# EAGLE design HerbScalesch (EAGLE 9.6.2)
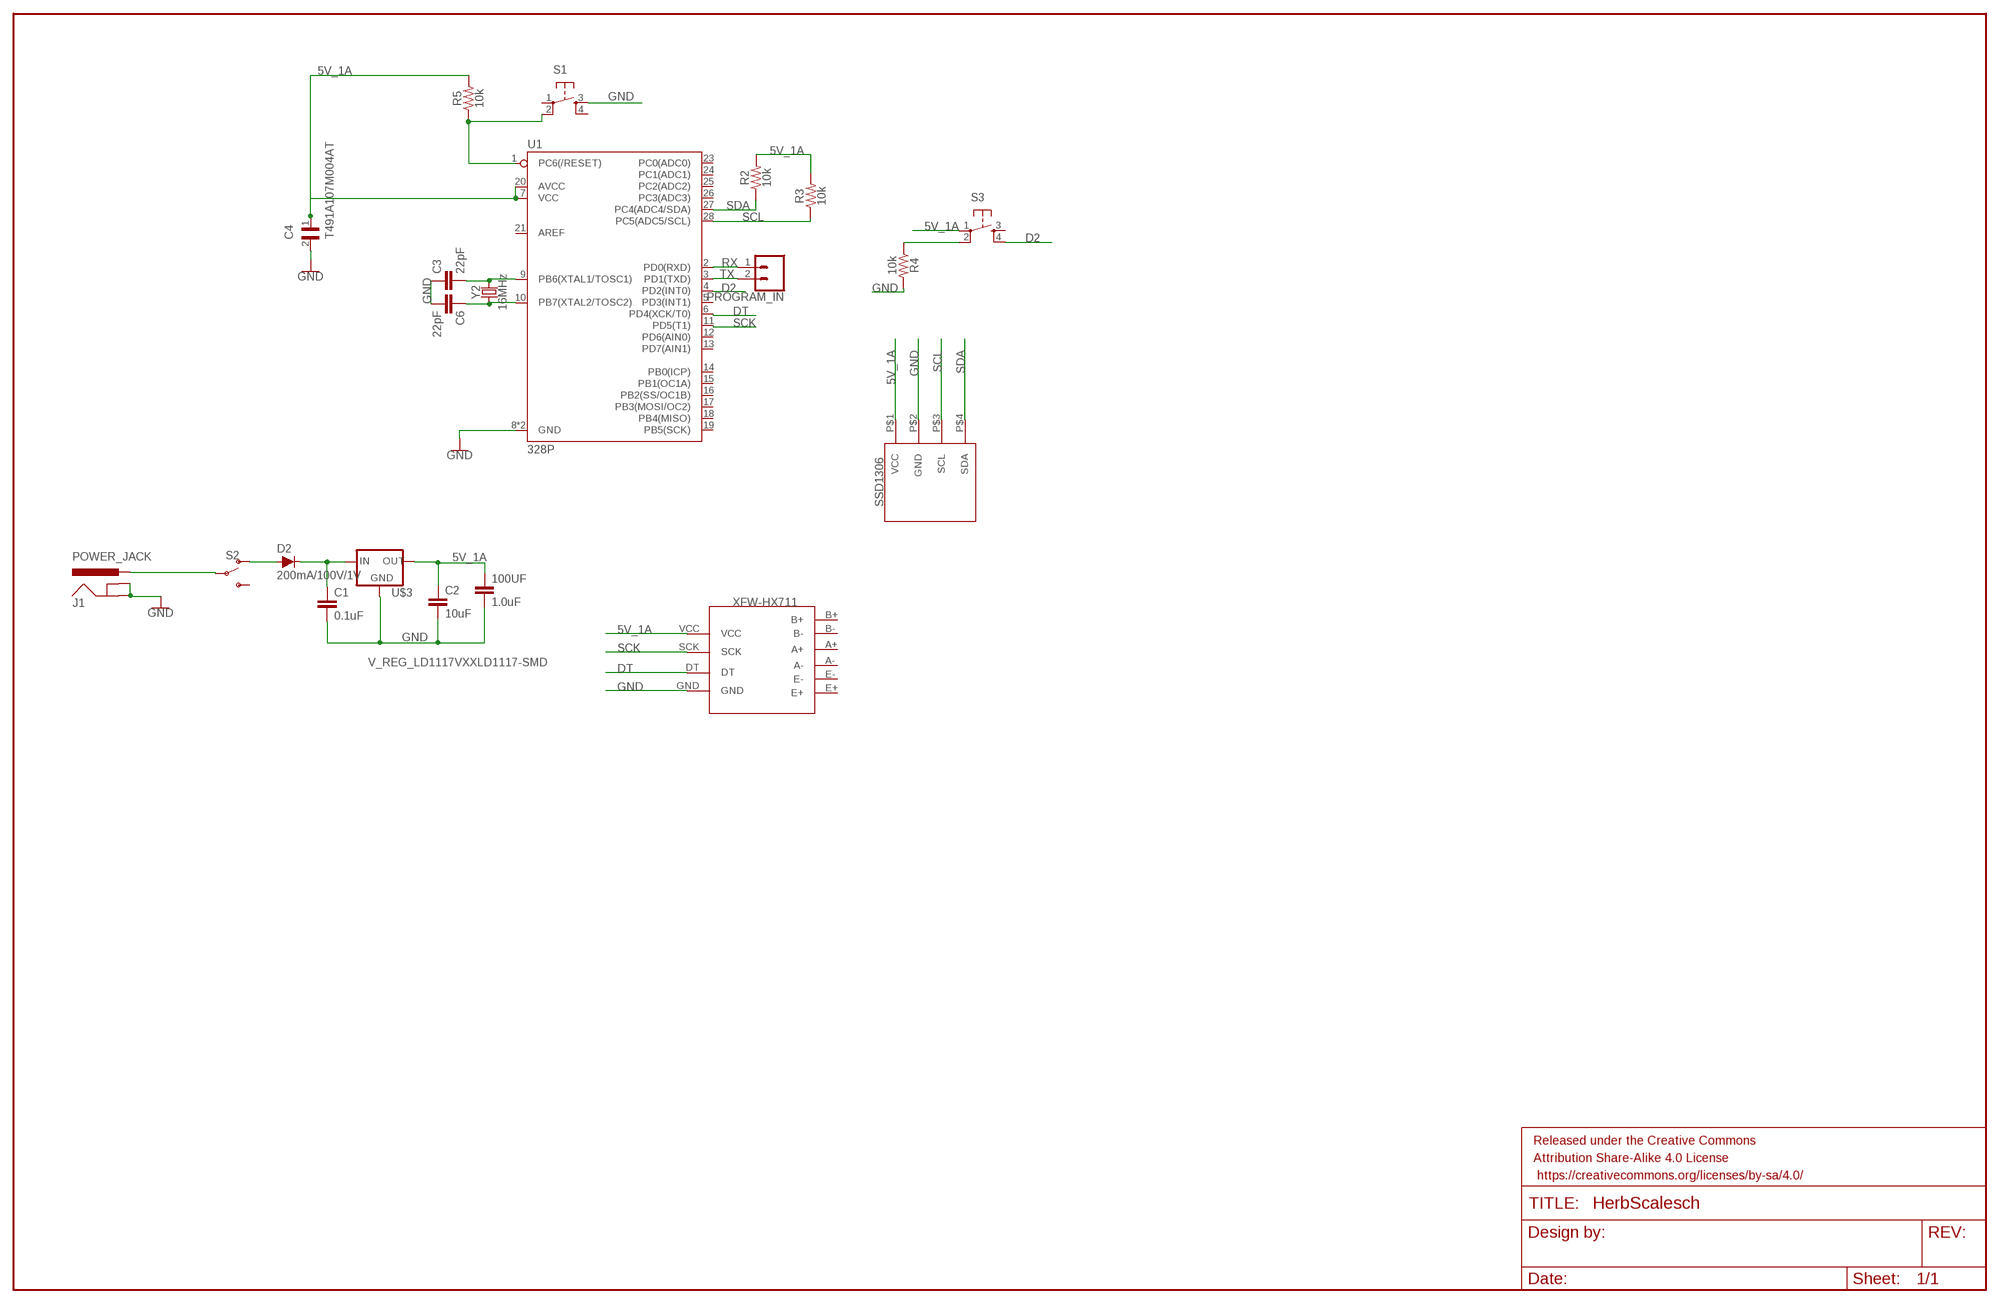
[diagram p0: schematic, sheet 1]

## Parts
100UF  1.0uF  1.0UF-1206-50V-10%  [1206]
C1  0.1uF  0.1UF-0603-25V-(+80/-20%)  [0603]
C2  10uF  10UF-0603-6.3V-20%  [0603]
C3  22pF  22PF-PTH-2.54MM-200V-5%  [CAP-PTH-2.54]
C4  T491A107M004AT  [CAPC3216X110N]
C6  22pF  22PF-PTH-2.54MM-200V-5%  [CAP-PTH-2.54]
D2  200mA/100V/1V  DIODE-1N4148  [DIODE-1N4148]
FRAME1  FRAME-LEDGER  [CREATIVE_COMMONS]
J1  POWER_JACK  [POWER_JACK_PTH]
PROGRAM_IN  CONN_02  [1X02]
R2  10k  10KOHM-HORIZ-1/4W-5%  [AXIAL-0.3]
R3  10k  10KOHM-HORIZ-1/4W-5%  [AXIAL-0.3]
R4  10k  10KOHM-HORIZ-1/4W-5%  [AXIAL-0.3]
R5  10k  10KOHM-HORIZ-1/4W-5%  [AXIAL-0.3]
S1  TAC_SWITCHPTH  [TACTILE-PTH]
S2  SWITCH-SPDT-PTH-11.6X4.0MM  [SWITCH_SPDT_PTH_11.6X4.0MM]
S3  TAC_SWITCHPTH  [TACTILE-PTH]
U1  328P  ATMEGA328P_PDIP  [DIP28]
U$1  SSD1306  [SSD1306]
U$2  XFW-HX711  [XFW-HX711]
U$3  V_REG_LD1117VXXLD1117-SMD  [SOT223]
Y2  16MHz  CRYSTAL-16MHZPTH-HC49US  [HC49US]

## Nets
5V_1A [5V]: 100UF.1 C2.1 C4.1 R2.P$2 R3.P$2 R5.P$2 S3.1 U1.7(VCC) U1.20(AVCC) U$1.P$1(VCC) U$2.VCC U$3.2(OUT)
D2 [Coms]: S3.4 U1.4(PD2(INT0))
DT [Coms]: U1.6(PD4(XCK/T0)) U$2.DT
GND: 100UF.2 C1.2 C2.2 C3.1 C4.2 C6.2 J1.GND J1.GNDBREAK R4.P$2 S1.3 U1.8(GND) U1.22(GND) U$1.P$2(GND) U$2.GND U$3.1(GND)
N$2 [5V]: C3.2 U1.9(PB6(XTAL1/TOSC1)) Y2.2
N$3: R5.P$1 S1.2 U1.1(PC6(/RESET))
N$4 [New Class]: D2.A S2.1(O)
N$5 [New Class]: C1.1 D2.C U$3.3(IN)
N$6 [5V]: C6.1 U1.10(PB7(XTAL2/TOSC2)) Y2.1
N$8: R4.P$1 S3.2
N$10 [New Class]: J1.PWR S2.2(P)
RX [Coms]: PROGRAM_IN.1 U1.2(PD0(RXD))
SCK [Coms]: U1.11(PD5(T1)) U$2.SCK
SCL [Coms]: R3.P$1 U1.28(PC5(ADC5/SCL)) U$1.P$3(SCL)
SDA [Coms]: R2.P$1 U1.27(PC4(ADC4/SDA)) U$1.P$4(SDA)
TX [Coms]: PROGRAM_IN.2 U1.3(PD1(TXD))
Unconnected: S1.1 S1.4 S2.3(S) S3.3 U1.5(PD3(INT1)) U1.12(PD6(AIN0)) U1.13(PD7(AIN1)) U1.14(PB0(ICP)) U1.15(PB1(OC1A)) U1.16(PB2(SS/OC1B)) U1.17(PB3(MOSI/OC2)) U1.18(PB4(MISO)) U1.19(PB5(SCK)) U1.21(AREF) U1.23(PC0(ADC0)) U1.24(PC1(ADC1)) U1.25(PC2(ADC2)) U1.26(PC3(ADC3)) U$2.A+ U$2.A- U$2.B+ U$2.B- U$2.E+ U$2.E-

## Library data of the parts
100UF = SparkFun-Capacitors:1.0UF: 1µF ceramic capacitors A capacitor is a passive two-terminal electrical component used to store electrical energy temporarily in an electric field.; PROD_ID: CAP-09822
C1 = SparkFun-Capacitors:0.1UF: 0.1µF ceramic capacitors A capacitor is a passive two-terminal electrical component used to store electrical energy temporarily in an electric field.; PROD_ID: CAP-00810
C2 = SparkFun-Capacitors:10UF: 10.0µF ceramic capacitors A capacitor is a passive two-terminal electrical component used to store electrical energy temporarily in an electric field.; PROD_ID: CAP-11015
C3 C6 = SparkFun-Capacitors:22PF: 22pF ceramic capacitors A capacitor is a passive two-terminal electrical component used to store electrical energy temporarily in an electric field.; PROD_ID: CAP-09128
C4 = T491A107M004AT:T491A107M004AT: Tantalum Capacitor; Capacitor Type:Solid; Capacitance:100µF; Capacitance Tolerance:± 20%; Voltage Rating:4VDC; Capacitor Dielectric Type:Tantalum; Package/Case:3216-18; Termination Type:SMD; ESR:4ohm; Leaded Process Compatible:Yes ;RoHS Compliant: Yes Check availability <https://pricing.snapeda.com/parts/T491A107M004AT/KEMET/view-part?ref=eda>; AVAILABILITY: In Stock; CHECK_PRICES: https://www.snapeda.com/parts/T491A107M004AT/KEMET/view-part/?ref=eda; DESCRIPTION: Capacitors Tantalum PCB 100uF SMD Tol 20% 4 VDC Case Size 3216 T491 Series | KEMET T491A107M004AT; MF: KEMET; MP: T491A107M004AT; PACKAGE: SMD-2 KEMET; PRICE: None; PURCHASE-URL: https://www.snapeda.com/api/url_track_click_mouser/?unipart_id=577514&manufacturer=KEMET&part_name=T491A107M004AT&search_term=t491a107m004at; SNAPEDA_LINK: https://www.snapeda.com/parts/T491A107M004AT/KEMET/view-part/?ref=snap
D2 = SparkFun-DiscreteSemi:DIODE: Diode These are standard reverse protection diodes and small signal diodes. SparkFun Products: SparkFun SparkPunk Sound Kit <https://www.sparkfun.com/products/11177> SparkFun ESP8266 Thing <https://www.sparkfun.com/products/13231>; PROD_ID: DIO-08378
FRAME1 = SparkFun-Aesthetics:FRAME-LEDGER: Schematic Frame - Ledger Standard 11x14 US Ledger frame
J1 = SparkFun-Connectors:POWER_JACK: Power Jack Connector This is the standard 5.5mm barrel jack for power. The PTH is the most common, proven, reliable, footprint. The Slot footprint only works if the mill layer is transmitted to the PCB fab house so be warned. Here are the connectors we sell at SparkFun: DC Barrel Power Jack/Connector <https://www.sparkfun.com/products/119> (PRT-00119) DC Barrel Power Jack/Connector (SMD) <https://www.sparkfun.com/products/12748> (PRT-12748) DC Barrel Jack Adapter - Breadboard Compatible <https://www.sparkfun.com/products/10811> (PRT-10811) It is used on this SparkFun product (and many, many others): SparkFun RedBoard - Programmed with Arduino <https://www.sparkfun.com/products/12757> (DEV-12757) Also, if you need a mating power supply or connector, please check these out: Wall Adapter Power Supply - 9VDC 650mA <https://www.sparkfun.com/products/298> (TOL-00298) DC Barrel Jack Adapter - Male <https://www.sparkfun.com/products/10287> (PRT-10287); PROD_ID: CONN-08197
PROGRAM_IN = SparkFun-Connectors:CONN_02: Multi connection point. Often used as Generic Header-pin footprint for 0.1 inch spaced/style header connections On any of the 0.1 inch spaced packages, you can populate with these: Break Away Headers - Straight <https://www.sparkfun.com/products/116> (PRT-00116) Break Away Male Headers - Right Angle <https://www.sparkfun.com/products/553> (PRT-00553) Female Headers <https://www.sparkfun.com/products/115> (PRT-00115) Break Away Headers - Machine Pin <https://www.sparkfun.com/products/117> (PRT-00117) Break Away Female Headers - Swiss Machine Pin <https://www.sparkfun.com/products/743> (PRT-00743) For SCREWTERMINALS and SPRING TERMINALS visit here: Screw Terimnals on SparkFun.com <https://www.sparkfun.com/search/results?term=Screw+Terminals> (5mm/3.5mm/2.54mm spacing) This device is also useful as a general connection point to wire up your design to another part of your project. Our various solder wires solder well into these plated through hole pads. Hook-Up Wire - Assortment (Stranded, 22 AWG) <https://www.sparkfun.com/products/11375> (PRT-11375) Hook-Up Wire - Assortment (Solid Core, 22 AWG) <https://www.sparkfun.com/products/11367> (PRT-11367) View the entire wire category on our website here <https://www.sparkfun.com/categories/141> Special notes: Molex polarized connector foot print use with: PRT-08233 with associated crimp pins and housings. 2.54_SCREWTERM for use with PRT-10571. 3.5mm Screw Terminal footprints for PRT-08084 5mm Screw Terminal footprints for use with PRT-08432
R2-R5 = SparkFun-Resistors:10KOHM: 10kΩ resistor A resistor is a passive two-terminal electrical component that implements electrical resistance as a circuit element. Resistors act to reduce current flow, and, at the same time, act to lower voltage levels within circuits. - Wikipedia; PROD_ID: RES-09435
S1 S3 = SparkFun-Retired:TAC_SWITCH: Momentary Switch Button commonly used for reset or general input. Spark Fun Electronics SKU : COM-00097 SMT- SWCH-08247
S2 = SparkFun-Switches:SWITCH-SPDT: Single Pole, Double Throw (SPDT) Switch Single-pole, double-throw (SPDT) switch. Variant Overview SMD-AYZ0202 Surface Mount DPDT Switch <https://www.sparkfun.com/products/597> (COM-00597) Used on e.g. LilyPad Arduino USB - ATmega32U4 Board <https://www.sparkfun.com/products/12049> PTH-11.6X4.0MM SPDT Mini Power Switch <https://www.sparkfun.com/products/102> (COM-00102) Used on e.g. SparkFun Simon Says - Through-Hole Soldering Kit <https://www.sparkfun.com/products/10547> (KIT-10547) PTH-11.6X4.0MM-KIT KIT version of SPDT Mini Power Switch - Simplifies soldering by removing tStop of switch pins - only one side can be soldered. PTH-11.6X4.0MM-LOCK LOCK version of SPDT Mini Power Switch - Offset pins hold switch in place for easier soldering. SMD-RIGHT-ANGLE Surface Mount Right Angle Switch <https://www.sparkfun.com/products/10860> (COM-10860) Used on e.g. SparkFun ESP8266 Thing <https://www.sparkfun.com/products/13231>; PROD_ID: SWCH-08261; SF_SKU: COM-00102
U1 = SparkFun-IC-Microcontroller:ATMEGA328P_PDIP: Atmel 328P Through hole ATMEGA328P uC used in the Arduino 32kb flash, 1k EEPROM, 2k SRAM Datasheet <http://www.sparkfun.com/datasheets/Components/SMD/ATMega328.pdf> SparkFun Products Storefront component: AVR 28 Pin 20MHz 32K 6A/D - ATMega328P <https://www.sparkfun.com/products/9061> (COM-09061) SparkFun Simon Says - Through-Hole Soldering Kit <https://www.sparkfun.com/products/10547> (KIT-10547) SparkFun Learn to Solder - Simon Says <https://www.sparkfun.com/products/13708> (KIT-13708) SparkFun BigTime Watch Kit <https://www.sparkfun.com/products/11734> (KIT-11734) SparkFun ClockIt <https://www.sparkfun.com/products/10930> (KIT-10930) SparkFun Serial Enabled LCD Kit <https://www.sparkfun.com/products/10097> (LCD-10097) SparkFun Simon Tilts - Through Hole Soldering Kit <https://www.sparkfun.com/products/12634> (KIT-12634) SparkFun Frequency Counter Kit <https://www.sparkfun.com/products/10140> (KIT-10140) FabFM Radio Kit <https://www.sparkfun.com/products/11043> (KIT-11043) SparkFun Binary Blaster Kit <https://www.sparkfun.com/products/12037> (KIT-12037) SparkFun Metro-Gnome <https://www.sparkfun.com/products/9236> (KIT-09236) ATmega328 with Arduino Optiboot (Uno) <https://www.sparkfun.com/products/10524> (DEV-10524); PROD_ID: IC-09136
U$1 = SV-Misc:SSD1306: Arduino OLED SSD1306
U$2 = SV-Misc:XFW-HX711
U$3 = SparkFun-IC-Power:V_REG_LD1117VXX: LD1117VXX voltage regulator. We carry the 3.3V version (COM-00526) in TO-220 package.; PROD_ID: VREG-13917
Y2 = SparkFun-Clocks:CRYSTAL-16MHZ: 16MHz Crystal Digikey Example <http://www.digikey.com/product-search/en?keywords=535-9122-1-ND> Frequency: 16MHz Frequency Stability: ±50ppm Frequency Tolerance: ±20ppm Load Capacitance: 18pF SparkFun Products: Pro Micro -5V/16MHz <https://www.sparkfun.com/products/12640> SparkFun Serial Enabled LCD Kit <https://www.sparkfun.com/products/10097>; PROD_ID: XTAL-08181; SF_ID: COM-00536

## Net classes
0 GND: width 0.508 mm
1 New Class: width 0.508 mm
2 5V: width 0.305 mm
3 Coms: width 0.254 mm

## Board
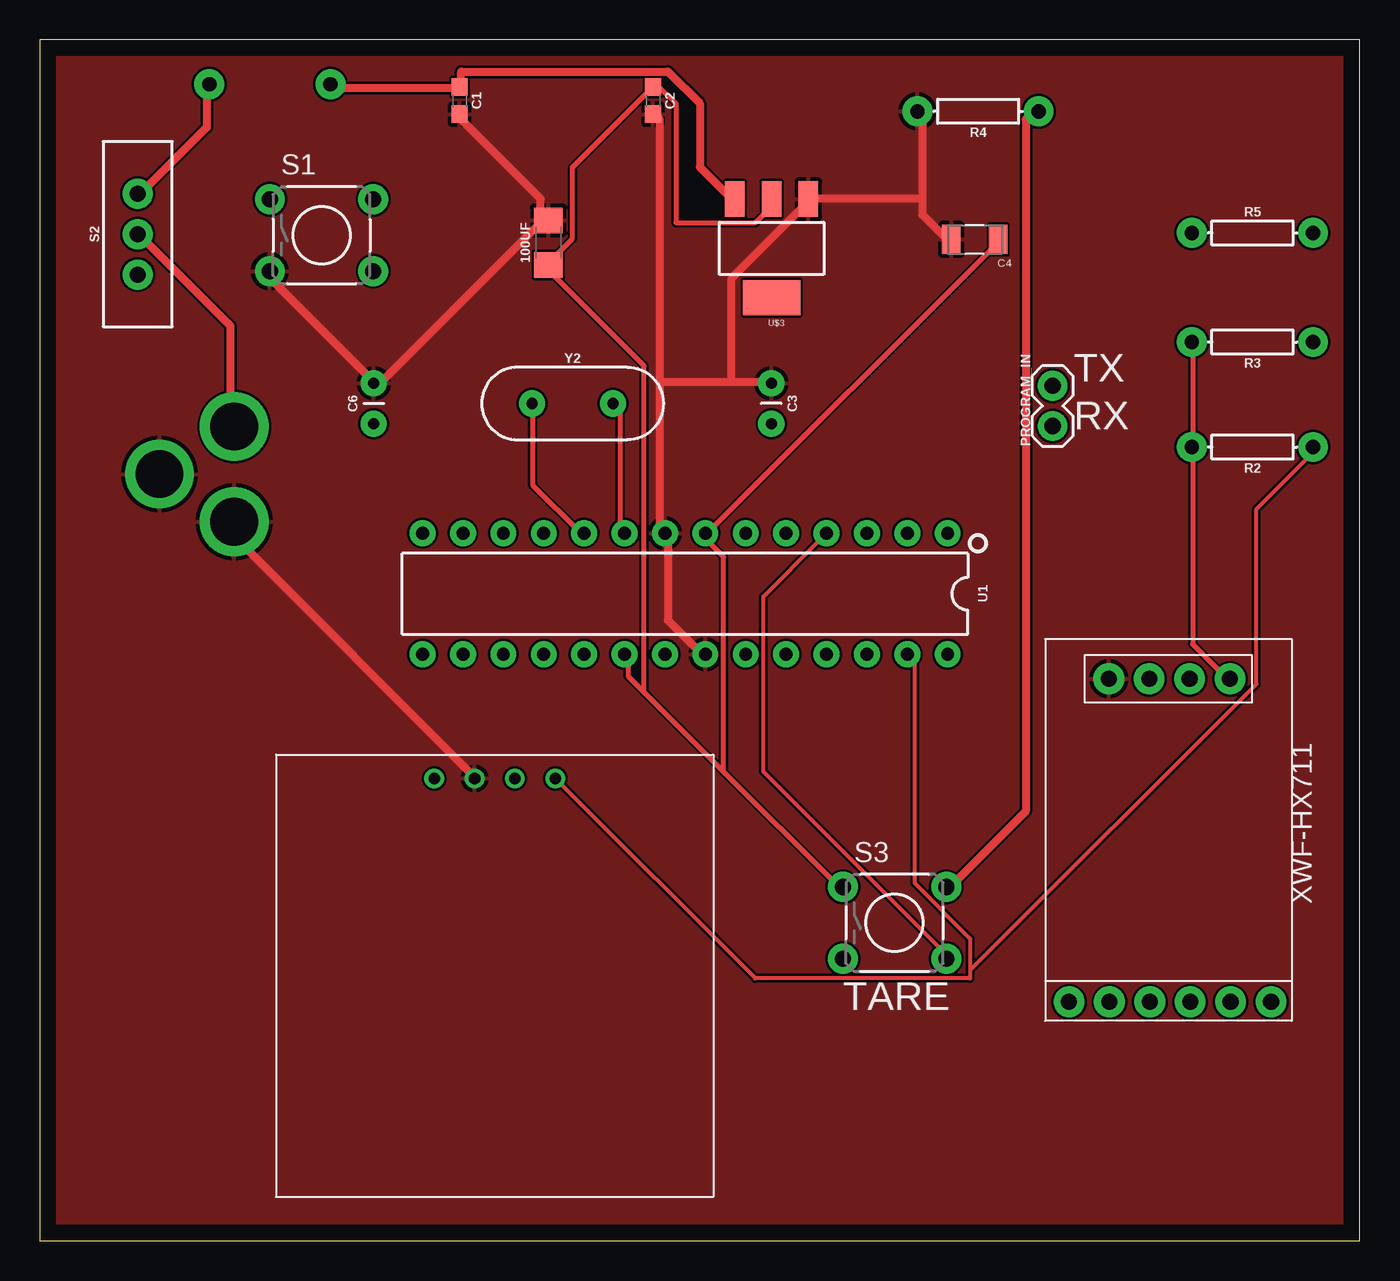
[diagram p1: board, top side]
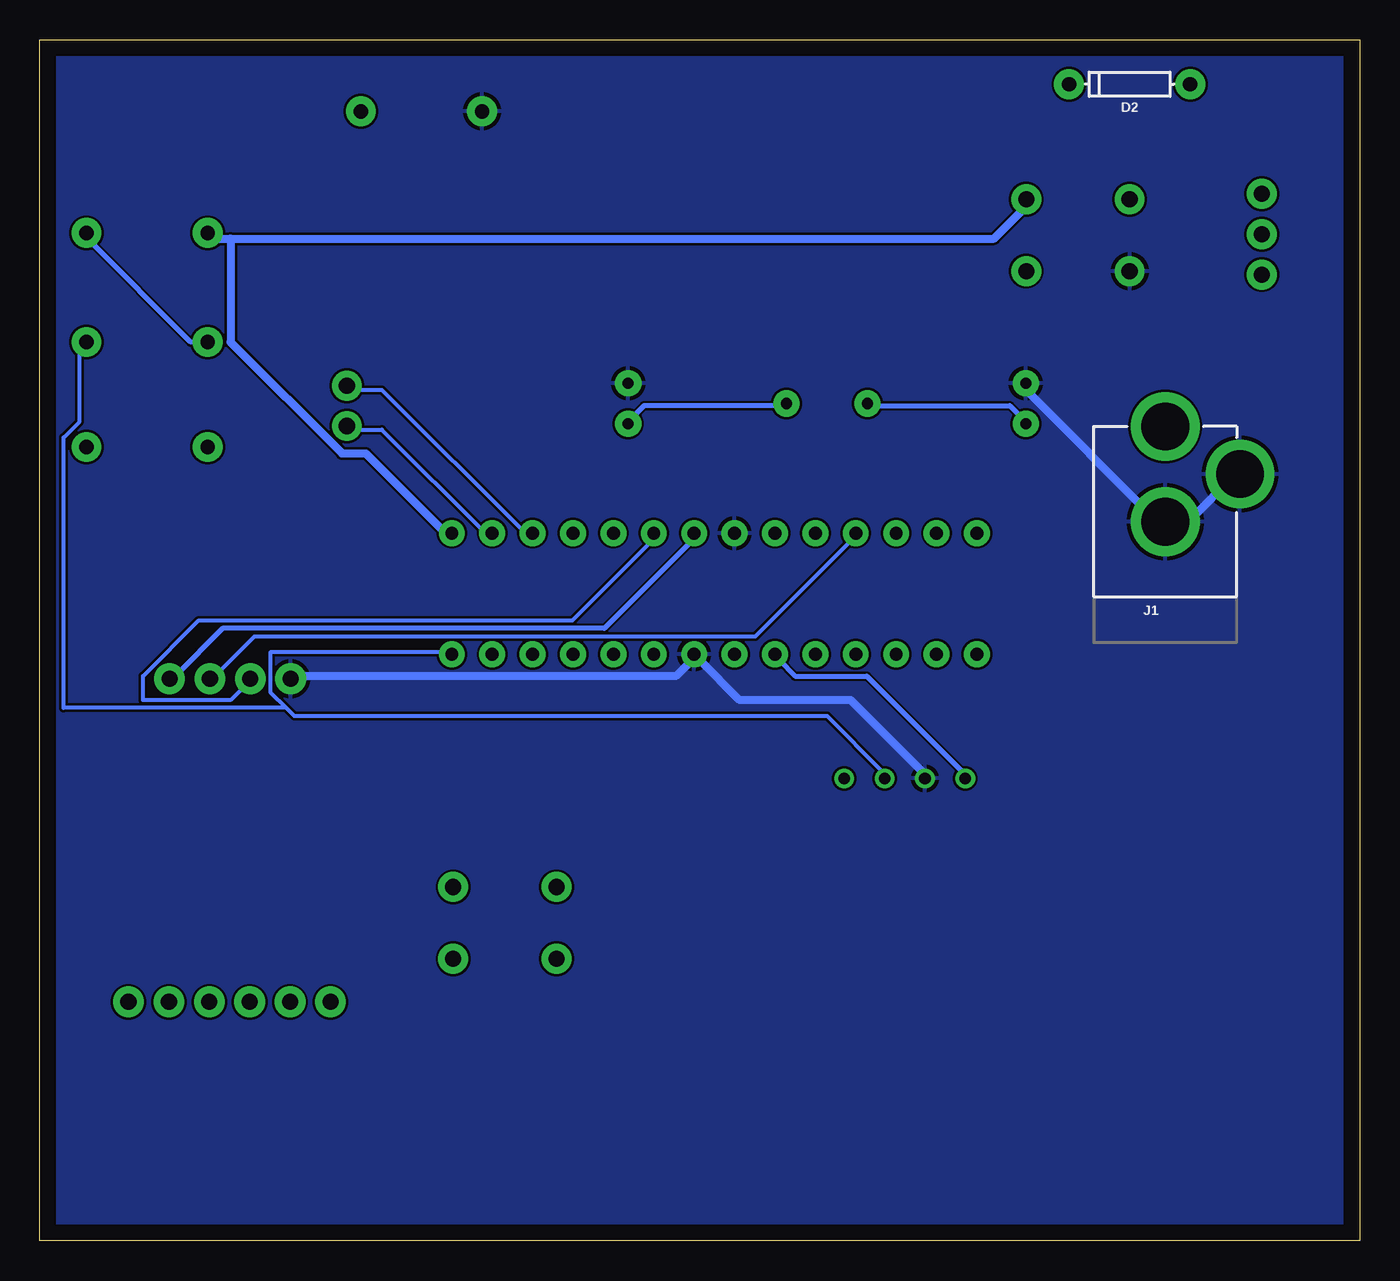
[diagram p2: board, bottom side, seen from below]

Size 83 x 75.5 mm. Coordinates in mm from the lower left corner, seen from the top.
Outline: 0,0 83,0 83,75.5 0,75.5 0,0
Copper layers (1*16): Top 0.035mm / dielectric 1.5mm / Bottom 0.035mm
Design rules "default": minimum track width 6mil, minimum drill 0.35mm, track to track 6mil, track to pad 6mil, pad to pad 6mil, via to via 6mil, smd to smd 6mil, copper to edge 40mil, drill to drill 6mil, minimum pad ring 10mil, minimum via ring 8mil, stop-mask expansion 4mil, vias tented up to drill 0mil, thermal gap 10mil

### Footprints (pad centres in the part's own frame; a part is rotated, then mirrored left to right if it is on the bottom)
1206 = smd 1.6 x 1.8: 1 -1.4,0; 2 1.4,0
0603 = smd 1.1 x 1: 1 -0.85,0; 2 0.85,0
CAP-PTH-2.54 = drill 0.7 pad 1.651: 1 -1.27,0; 2 1.27,0
CAPC3216X110N = smd 1.16 x 1.82: 1 -1.475,0; 2 1.475,0
DIODE-1N4148 = drill 0.9 pad 1.88: A -3.81,0; C 3.81,0
POWER_JACK_PTH = drill 2.997 pad 4.318: GND 0,7.7; GNDBREAK 4.7,10.7; PWR 0,13.7
1X02 = drill 1.016 pad 1.88: 1 0,0; 2 2.54,0
AXIAL-0.3 = drill 0.9 pad 1.88: P$1 -3.81,0; P$2 3.81,0
TACTILE-PTH = drill 1.016 pad 1.88: 1 -3.251,2.261; 2 3.251,2.261; 3 -3.251,-2.261; 4 3.251,-2.261
SWITCH_SPDT_PTH_11.6X4.0MM = drill 1.016 pad 1.88: 1 0,2.54; 2 0,0; 3 0,-2.54
DIP28 = drill 0.813 pad 1.626: 1 -16.51,-3.81; 2 -13.97,-3.81; 3 -11.43,-3.81; 4 -8.89,-3.81; 5 -6.35,-3.81; 6 -3.81,-3.81; 7 -1.27,-3.81; 8 1.27,-3.81; 9 3.81,-3.81; 10 6.35,-3.81; 11 8.89,-3.81; 12 11.43,-3.81; 13 13.97,-3.81; 14 16.51,-3.81; 15 16.51,3.81; 16 13.97,3.81; 17 11.43,3.81; 18 8.89,3.81; 19 6.35,3.81; 20 3.81,3.81; 21 1.27,3.81; 22 -1.27,3.81; 23 -3.81,3.81; 24 -6.35,3.81; 25 -8.89,3.81; 26 -11.43,3.81; 27 -13.97,3.81; 28 -16.51,3.81
SSD1306 = drill 0.73: P$1 9.94,26.3; P$2 12.48,26.3; P$3 15.02,26.3; P$4 17.56,26.3
XFW-HX711 = drill 1.016 pad 1.93: A+ 22.8,9.12; A- 22.8,6.58; B+ 22.8,14.2; B- 22.8,11.66; DT 2.5,6.54; E+ 22.8,1.5; E- 22.8,4.04; GND 2.5,4; SCK 2.5,9.08; VCC 2.5,11.62
SOT223 = smd 1.219 x 2.235: 1 -2.311,-3.099; 2 0,-3.099; 3 2.311,-3.099 | smd 3.6 x 2.2: 4 0,3.099
HC49US = drill 0.7 pad 1.651: 1 -2.54,0; 2 2.54,0

### Placement (x,y rotation side)
100UF  31.98,62.75 90 top
C1  26.4,71.67 270 top
C2  38.56,71.67 270 top
C3  46,52.64 270 top
C4  58.79,62.95 180 top
C6  21,52.64 90 top
D2  14.47,72.71 180 bottom
FRAME1  -80.01,34.84 0 top  (outside the outline)
J1  12.23,37.5 0 bottom
PROGRAM_IN  63.69,51.22 90 top
R2  76.25,49.9 180 top
R3  76.25,56.5 180 top
R4  59,71 180 top
R5  76.25,63.36 0 top
S1  17.72,63.22 0 top
S2  6.16,63.28 0 top
S3  53.75,19.99 0 top
U1  40.58,40.68 180 top
U$1  14.86,2.77 0 top
U$2  63.22,37.83 270 top
U$3  46.02,62.39 180 top
Y2  33.5,52.64 0 top

### Tracks (layer width: path | path; a pad name or v marks a point on that pad's centre or on a via)
5V_1A
  Top 0.305: R3.P$2 72.5,56.5 72.5,50 R2.P$2 72.5,49.5 72.5,37.5 74.5,35.5 U$2.VCC | C4.1 60,62.5 42,44.5 U1.7 42,44 43,43 43,29.5 | U$3.2 46,65 45,64 40,64 40,71.5 39,72.5 C2.1 38.5,72.5 33.5,67.5 33.5,63 32,61.5 100UF.1 32,61 38,55 38,34.5 | 38,34.5 37,35.5 37,36.5 U1.20 | 38,34.5 43,29.5 | 43,29.5 50,22.5 S3.1
  Bottom 0.305: R3.P$2 73.5,56.5 80,63 R5.P$2 | U$1.P$1 25,29.5 31,35.5 35.5,35.5 36.5,36.5 U1.20 | U$2.VCC 74.5,35.5 71.5,38.5 47.5,38.5 42,44 U1.7
D2
  Top 0.254: U1.4 49,44 45.5,40.5 45.5,29.5 57,18 S3.4
DT
  Bottom 0.254: U1.6 44.5,44 49.5,39 73,39 76.5,35.5 76.5,34 71,34 70,35 U$2.DT
GND
  Top 0.508: 55.5,65.5 55.5,71 R4.P$2 | 55.5,65.5 55.5,64.5 57,63 C4.2 | 55.5,65.5 48.5,65.5 U$3.1 48,65 43.5,60.5 43.5,54 | 39,54 39,44.5 U1.8 39.5,44 39.5,39 41.5,37 U1.22 | 39,54 39,70.5 C2.2 | 39,54 43.5,54 | 43.5,54 46,54 C3.1 | C1.2 26.5,70.5 31.5,65.5 31.5,64.5 100UF.2 31.5,64 21,53.5 C6.2 21,54 14.5,60.5 S1.3 | U$1.P$2 27,29.5 12.5,44 12.5,45 J1.GND
  Bottom 0.508: U$2.GND 67,35.5 43,35.5 42,36.5 U1.22 41.5,36.5 39,34 32,34 27.5,29.5 U$1.P$2 | J1.GNDBREAK 8,48 10.5,45.5 12,45.5 J1.GND 12.5,45.5 13,45.5 21,53.5 C6.2
  pour Top: 0,75.5 83,75.5 83,0 0,0
  pour Bottom: 0,75.5 83,75.5 83,0 0,0
N$2
  Top 0.305: U1.9 36.5,44.5 36.5,52.5 Y2.2
  Bottom 0.305: C3.2 46,51.5 45,52.5 36.5,52.5 Y2.2
N$3
  Bottom 0.508: 71,63 71,56.5 64,49.5 62.5,49.5 57.5,44.5 U1.1 | 71,63 72,63 R5.P$1 | 71,63 23,63 21,65 S1.2
N$4
  Top 0.508: S2.1 6.5,66 10.5,70 10.5,72.5 D2.A
N$5
  Top 0.508: D2.C 18.5,72.5 26,72.5 C1.1 26.5,73 26.5,73.5 39.5,73.5 41.5,71.5 41.5,67.5 43.5,65.5 U$3.3
N$6
  Top 0.305: U1.10 34,44.5 31,47.5 31,52.5 Y2.1
  Bottom 0.305: C6.1 21,51.5 22,52.5 30.5,52.5 Y2.1
N$8
  Top 0.508: S3.2 57.5,22.5 62,27 62,70.5 62.5,71 R4.P$1
N$10
  Top 0.508: S2.2 6.5,63 12,57.5 12,51.5 J1.PWR
RX
  Bottom 0.254: U1.2 55,44.5 61.5,51 63.5,51 PROGRAM_IN.1
SCK
  Bottom 0.254: U1.11 32,44 38,38 69.5,38 72,35.5 U$2.SCK
SCL
  Bottom 0.254: 67.5,33.5 68.5,34.5 68.5,37 57.5,37 U1.28 | 67.5,33.5 67,33 33.5,33 30,29.5 U$1.P$3 | 67.5,33.5 81.5,33.5 81.5,50.5 80.5,51.5 80.5,56.5 R3.P$1
SDA
  Top 0.254: 58.5,17 58.5,19 55,22.5 55,36.5 U1.27 | 58.5,17 58.5,16.5 45,16.5 32.5,29 U$1.P$4 | 58.5,17 76.5,35 76.5,46 80,49.5 R2.P$1
TX
  Bottom 0.254: U1.3 52.5,44.5 61.5,53.5 63.5,53.5 PROGRAM_IN.2

### Text on the board
tNames: TX | RX | TARE